# Altium schematic sheet [7] - CONNECTORS.SchDoc
size A
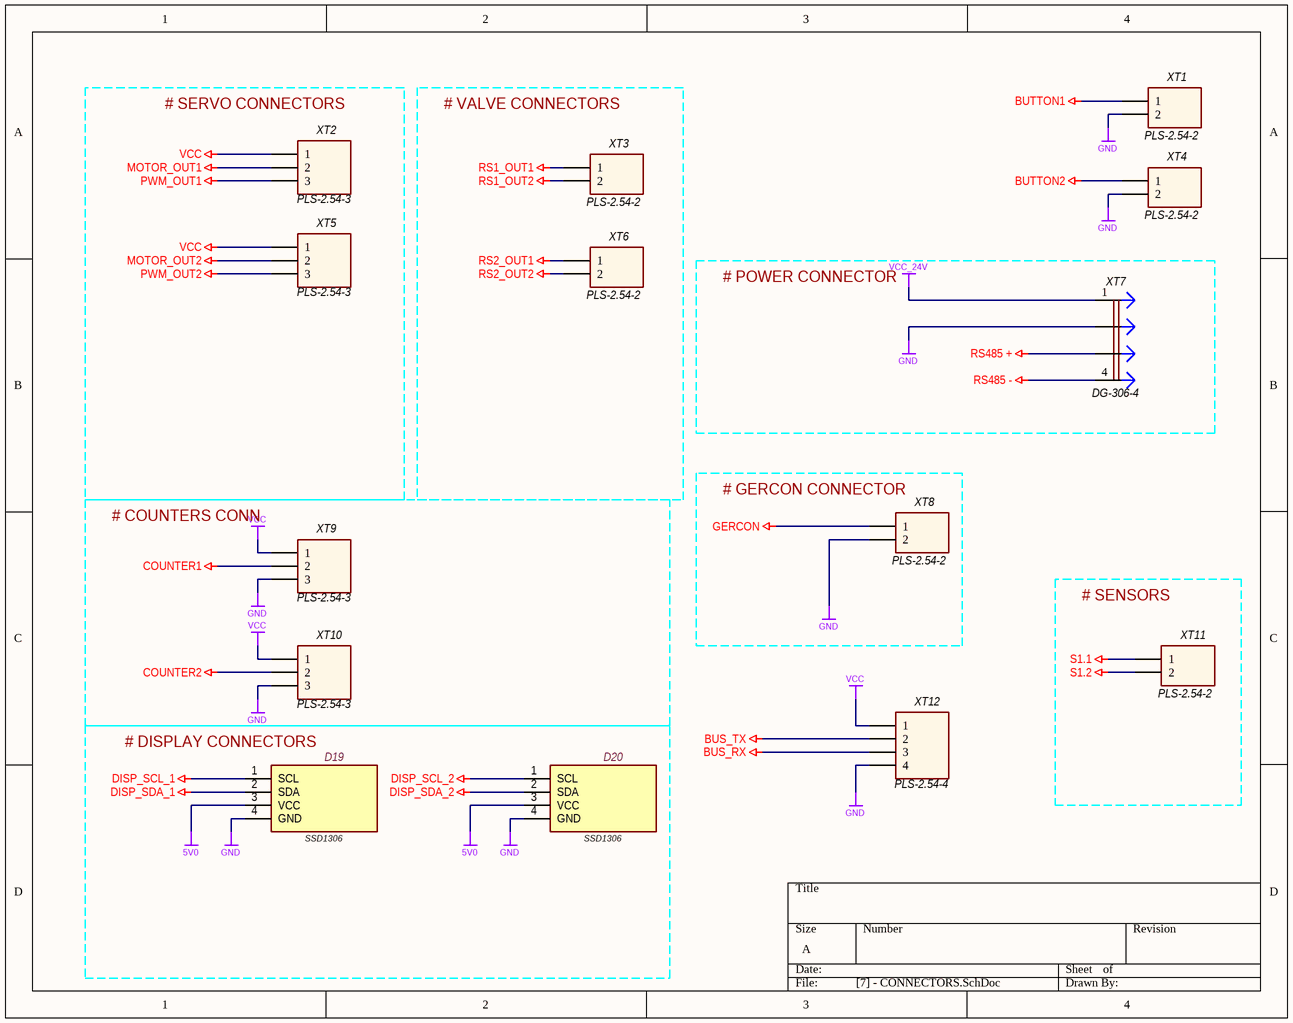
[diagram p0: [7] - CONNECTORS.SchDoc]

## Parts
D19  SSD1306  [SSD1306]
D20  SSD1306  [SSD1306]
XT1  PLS-2.54-2  [J1x2]
XT2  PLS-2.54-3  [J1x3]
XT3  PLS-2.54-2  [J1x2]
XT4  PLS-2.54-2  [J1x2]
XT5  PLS-2.54-3  [J1x3]
XT6  PLS-2.54-2  [J1x2]
XT7  DG-306-4
XT8  PLS-2.54-2  [J1x2]
XT9  PLS-2.54-3  [J1x3]
XT10  PLS-2.54-3  [J1x3]
XT11  PLS-2.54-2  [J1x2]
XT12  PLS-2.54-4  [J1x4]

## Blocks framed on the sheet
# SERVO CONNECTORS: XT2 XT5
# VALVE CONNECTORS: XT3 XT6
# POWER CONNECTOR: XT7
# COUNTERS CONN: XT9 XT10
# GERCON CONNECTOR: XT8
# SENSORS: XT11
# DISPLAY CONNECTORS: D19 D20

## Nets
5V0: D19.3(VCC) D20.3(VCC)
BUS_RX: XT12.3
BUS_TX: XT12.2
BUTTON1: XT1.1
BUTTON2: XT4.1
COUNTER1: XT9.2
COUNTER2: XT10.2
DISP_SCL_1: D19.1(SCL)
DISP_SCL_2: D20.1(SCL)
DISP_SDA_1: D19.2(SDA)
DISP_SDA_2: D20.2(SDA)
GERCON: XT8.1
GND: D19.4(GND) D20.4(GND) XT1.2 XT4.2 XT7.2 XT8.2 XT9.3 XT10.3 XT12.4
MOTOR_OUT1: XT2.2
MOTOR_OUT2: XT5.2
PWM_OUT1: XT2.3
PWM_OUT2: XT5.3
RS1_OUT1: XT3.1
RS1_OUT2: XT3.2
RS2_OUT1: XT6.1
RS2_OUT2: XT6.2
RS485 +: XT7.3
RS485 -: XT7.4
S1.1: XT11.1
S1.2: XT11.2
VCC: XT2.1 XT5.1 XT9.1 XT10.1 XT12.1
VCC_24V: XT7.1

## Library data of the parts
D19 D20 = SSD1306: 0.91″ min OLED display screen with 128X32 resoluction and SSD1306 chipset; MPN: SSD1306; Manufacturer: *; Supplier 1: *; Supplier 2: *; PackageReference: *; Value: SSD1306
XT1 XT3 XT4 XT6 XT8 XT11 = PLS-2.54-2: Header Connector  2.54 mm; Manufacturer: *; Supplier 1: *; ComponentLinkURL: *; ComponentLinkDescription: *; Supplier 2: *; PackageReference: *; MPN: *; Value: PLS-2.54-2
XT2 XT5 XT9 XT10 = PLS-2.54-3: Header Connector  2.54 mm; Manufacturer: *; Supplier 1: *; ComponentLinkURL: *; ComponentLinkDescription: *; Supplier 2: *; PackageReference: *; MPN: *; Value: PLS-2.54-3
XT7 = DG-306-4: Terminal Block 5.08mm; Manufacturer: *; Supplier 1: *; ComponentLinkURL: *; ComponentLinkDescription: *; Supplier 2: *; PackageReference: *; MPN: *; Value: DG-306-4
XT12 = PLS-2.54-4: Header Connector  2.54 mm; Manufacturer: *; Supplier 1: *; ComponentLinkURL: *; ComponentLinkDescription: *; Supplier 2: *; PackageReference: *; MPN: *; Value: PLS-2.54-4